# Altium schematic sheet IO.SchDoc
size A4
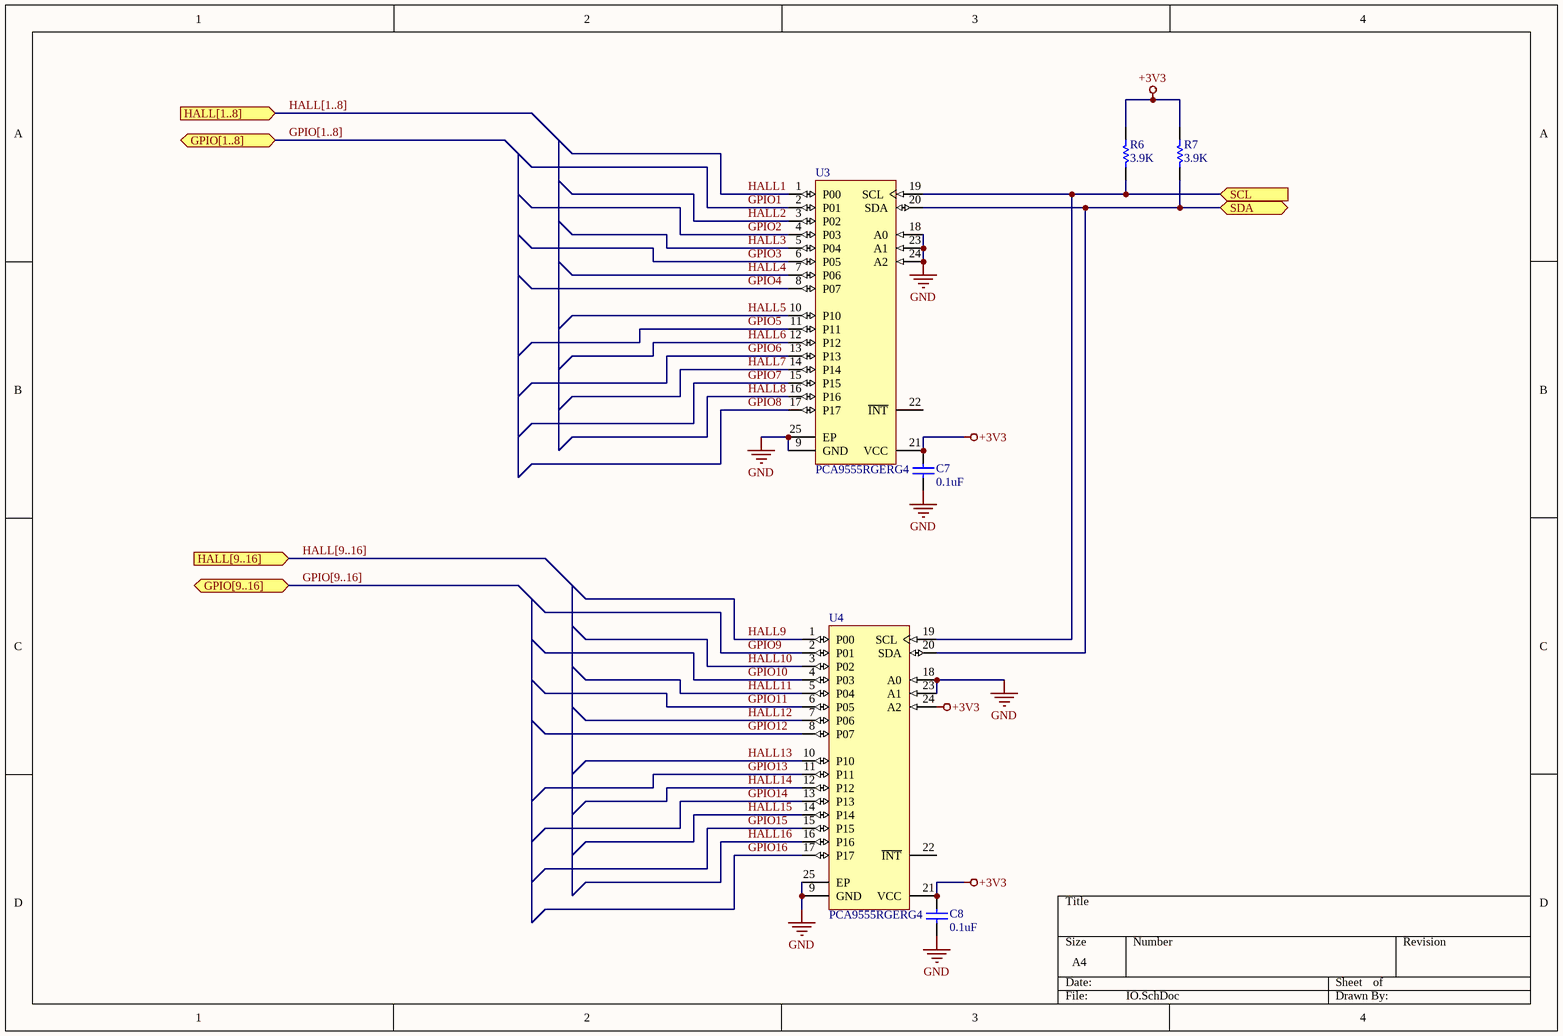
[diagram p0: IO.SchDoc]

## Parts
C7  0.1uF  [CAPC1608X87X35NL15T15]
C8  0.1uF  [CAPC1608X87X35NL15T15]
R6  3.9K  [RESC1608X55X30ML15T15]
R7  3.9K  [RESC1608X55X30ML15T15]
U3  PCA9555RGERG4  [RGE24-2100X2100TP]
U4  PCA9555RGERG4  [RGE24-2100X2100TP]

## Ports
GPIO[1..8] (bidir), GPIO[9..16] (bidir), HALL[1..8] (in), HALL[9..16] (in), SCL (in), SDA (bidir)

## Nets
+3V3: C7.1 C8.1 R6.2 R7.2 U3.21(VCC) U4.21(VCC) U4.24(A2)
GND: C7.2 C8.2 U3.9(GND) U3.18(A0) U3.23(A1) U3.24(A2) U3.25(EP) U4.9(GND) U4.18(A0) U4.23(A1) U4.25(EP)
GPIO1: U3.2(P01)
GPIO2: U3.4(P03)
GPIO3: U3.6(P05)
GPIO4: U3.8(P07)
GPIO5: U3.11(P11)
GPIO6: U3.13(P13)
GPIO7: U3.15(P15)
GPIO8: U3.17(P17)
GPIO9: U4.2(P01)
GPIO10: U4.4(P03)
GPIO11: U4.6(P05)
GPIO12: U4.8(P07)
GPIO13: U4.11(P11)
GPIO14: U4.13(P13)
GPIO15: U4.15(P15)
GPIO16: U4.17(P17)
HALL1: U3.1(P00)
HALL2: U3.3(P02)
HALL3: U3.5(P04)
HALL4: U3.7(P06)
HALL5: U3.10(P10)
HALL6: U3.12(P12)
HALL7: U3.14(P14)
HALL8: U3.16(P16)
HALL9: U4.1(P00)
HALL10: U4.3(P02)
HALL11: U4.5(P04)
HALL12: U4.7(P06)
HALL13: U4.10(P10)
HALL14: U4.12(P12)
HALL15: U4.14(P14)
HALL16: U4.16(P16)
SCL: R6.1 U3.19(SCL) U4.19(SCL) ; port SCL
SDA: R7.1 U3.20(SDA) U4.20(SDA) ; port SDA

Not connected (* = marked no-connect by the designer): U3 22(~{INT}); U4 22(~{INT})

## Buses and harness runs
bus GPIO[1..8] = port GPIO[1..8]
bus GPIO[9..16] = port GPIO[9..16]
bus HALL[1..8] = port HALL[1..8]
bus HALL[9..16] = port HALL[9..16]

## Library data of the parts
C7 C8 = CMP-2006-03300-1: Part Number: C0603X104K5RACTU; Manufacturer: Kemet
R6 R7 = CMP-2000-00180-1: Part Number: ERJ-3EKF1001V; Manufacturer: Panasonic
U3 U4 = CMP-0314-00040-1: Remote 16-Bit I2C and SMBus I/O Expander with Interrupt Output and Configuration Registers, 2.3 to 5.5 V, -40 to 85 degC, 24-pin VQFN (RGE), Green (RoHS & no Sb/Br); Manufacturer: Texas Instruments; No. of Outputs: 2; fSCLK(Max)(MHz): 400; 5V Tolerant I/O: Yes; VCC(Min)(V): 2.3; VCC(Max)(V): 5.5; # of I/Os: 16; SubFamily: I2C IO Expander; I2C Address: 0100 xxx; Eco-Plan: Green (RoHS & no Sb/Br); DatasheetVersion: SCPS131E; ComponentLink2Description: Package Specification; Mounting Technology: Surface Mount; PackageVersion: revG, Jul-2011; Push-Pull I/O Type: Yes; Configuration Registers: Yes; PackageReference: RGE24-2100X2100TP; Max Frequency(kHz): 400; ComponentLink1Description: Datasheet; ComponentLink2URL: http://www.ti.com/litv/pdf/mpds211a; Vcc range(V): 2.3 to 5.5; ComponentLink1URL: http://www.ti.com/general/docs/lit/getliterature.tsp?genericPartNumber=PCA9555&fileType=pdf; Interrupt Output: Yes; PackageDescription: 24-Pin Plastic Quad Flatpack No-Lead, 4 x 4 mm Body, 0.5 mm Pitch; Code_JEDEC: MO-220; PartNumber: PCA9555RGERG4